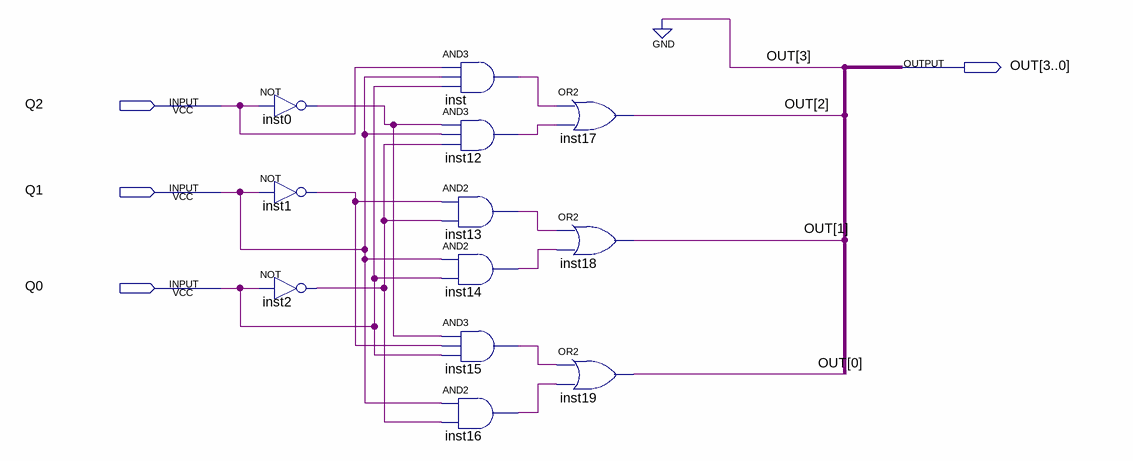
[diagram p0: schematic sheet]
// Quartus schematic DECODE.bdf as structural Verilog: 12 symbols, 4 pins
module DECODE (
  input  Q2,
  input  Q1,
  input  Q0,
  output [3:0] OUT
);

  wire inst0_out, inst1_out, inst2_out, inst12_out, inst13_out, inst14_out, inst15_out, inst16_out, inst_out;

  not inst0 (inst0_out, Q2);
  not inst1 (inst1_out, Q1);
  not inst2 (inst2_out, Q0);
  and inst (inst_out, Q2, Q1, Q0);
  and inst12 (inst12_out, inst0_out, Q1, inst2_out);
  and inst13 (inst13_out, inst1_out, inst2_out);
  and inst14 (inst14_out, Q1, Q0);
  and inst15 (inst15_out, inst0_out, inst1_out, Q0);
  and inst16 (inst16_out, Q1, inst2_out);
  or inst17 (OUT[2], inst_out, inst12_out);
  or inst18 (OUT[1], inst13_out, inst14_out);
  or inst19 (OUT[0], inst15_out, inst16_out);

  assign OUT[3] = 1'b0;
endmodule
